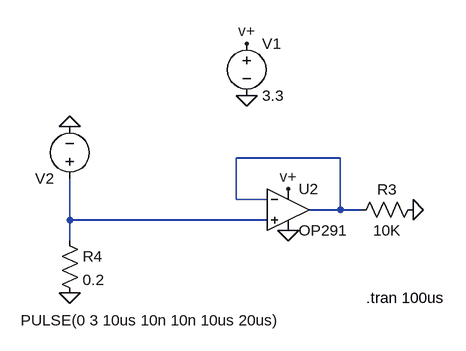
[diagram p0: schematic SlewRateTest.asc]
SlewRateTest.asc, the LTspice schematic file:
Version 4.1
SHEET 1 1048 764
WIRE 176 256 16 256
WIRE 16 320 16 256
WIRE 64 320 16 320
WIRE 176 336 176 256
WIRE 176 336 128 336
WIRE 208 336 176 336
WIRE -240 352 -240 288
WIRE 64 352 -240 352
WIRE -240 384 -240 352
FLAG 32 160 0
FLAG 32 80 v+
FLAG -240 208 0
FLAG 288 336 0
FLAG -240 464 0
FLAG 96 304 v+
FLAG 96 368 0
SYMBOL voltage 32 64 R0
WINDOW 123 0 0 Left 0
WINDOW 39 0 0 Left 0
SYMATTR InstName V1
SYMATTR Value 3.3
SYMBOL voltage -240 304 R180
WINDOW 3 -325 -202 Left 2
WINDOW 123 0 0 Left 0
WINDOW 39 0 0 Left 0
SYMATTR Value PULSE(0 3 10us 10n 10n 10us 20us)
SYMATTR InstName V2
SYMBOL res 304 320 R90
WINDOW 0 0 56 VBottom 2
WINDOW 3 32 56 VTop 2
SYMATTR InstName R3
SYMATTR Value 10K
SYMBOL res -256 368 R0
SYMATTR InstName R4
SYMATTR Value 0.2
SYMBOL OpAmps\\OP291 96 272 R0
SYMATTR InstName U2
TEXT 216 472 Left 2 !.tran 100us

The netlist it stands for:
* SlewRateTest.asc
V1 v+ 0 3.3
V2 N002 0 PULSE(0 3 10us 10n 10n 10us 20us)
R3 0 N001 10K
R4 N002 0 0.2
X§U2 N002 N001 v+ 0 N001 OP291  ; pins In+ In- V+ V- OUT
.tran 100us
.backanno
.end